# Altium schematic sheet [02] - BLOCK DIAGRAM.SchDoc
size A3; SheetNumber: 1; SheetTotal: 2
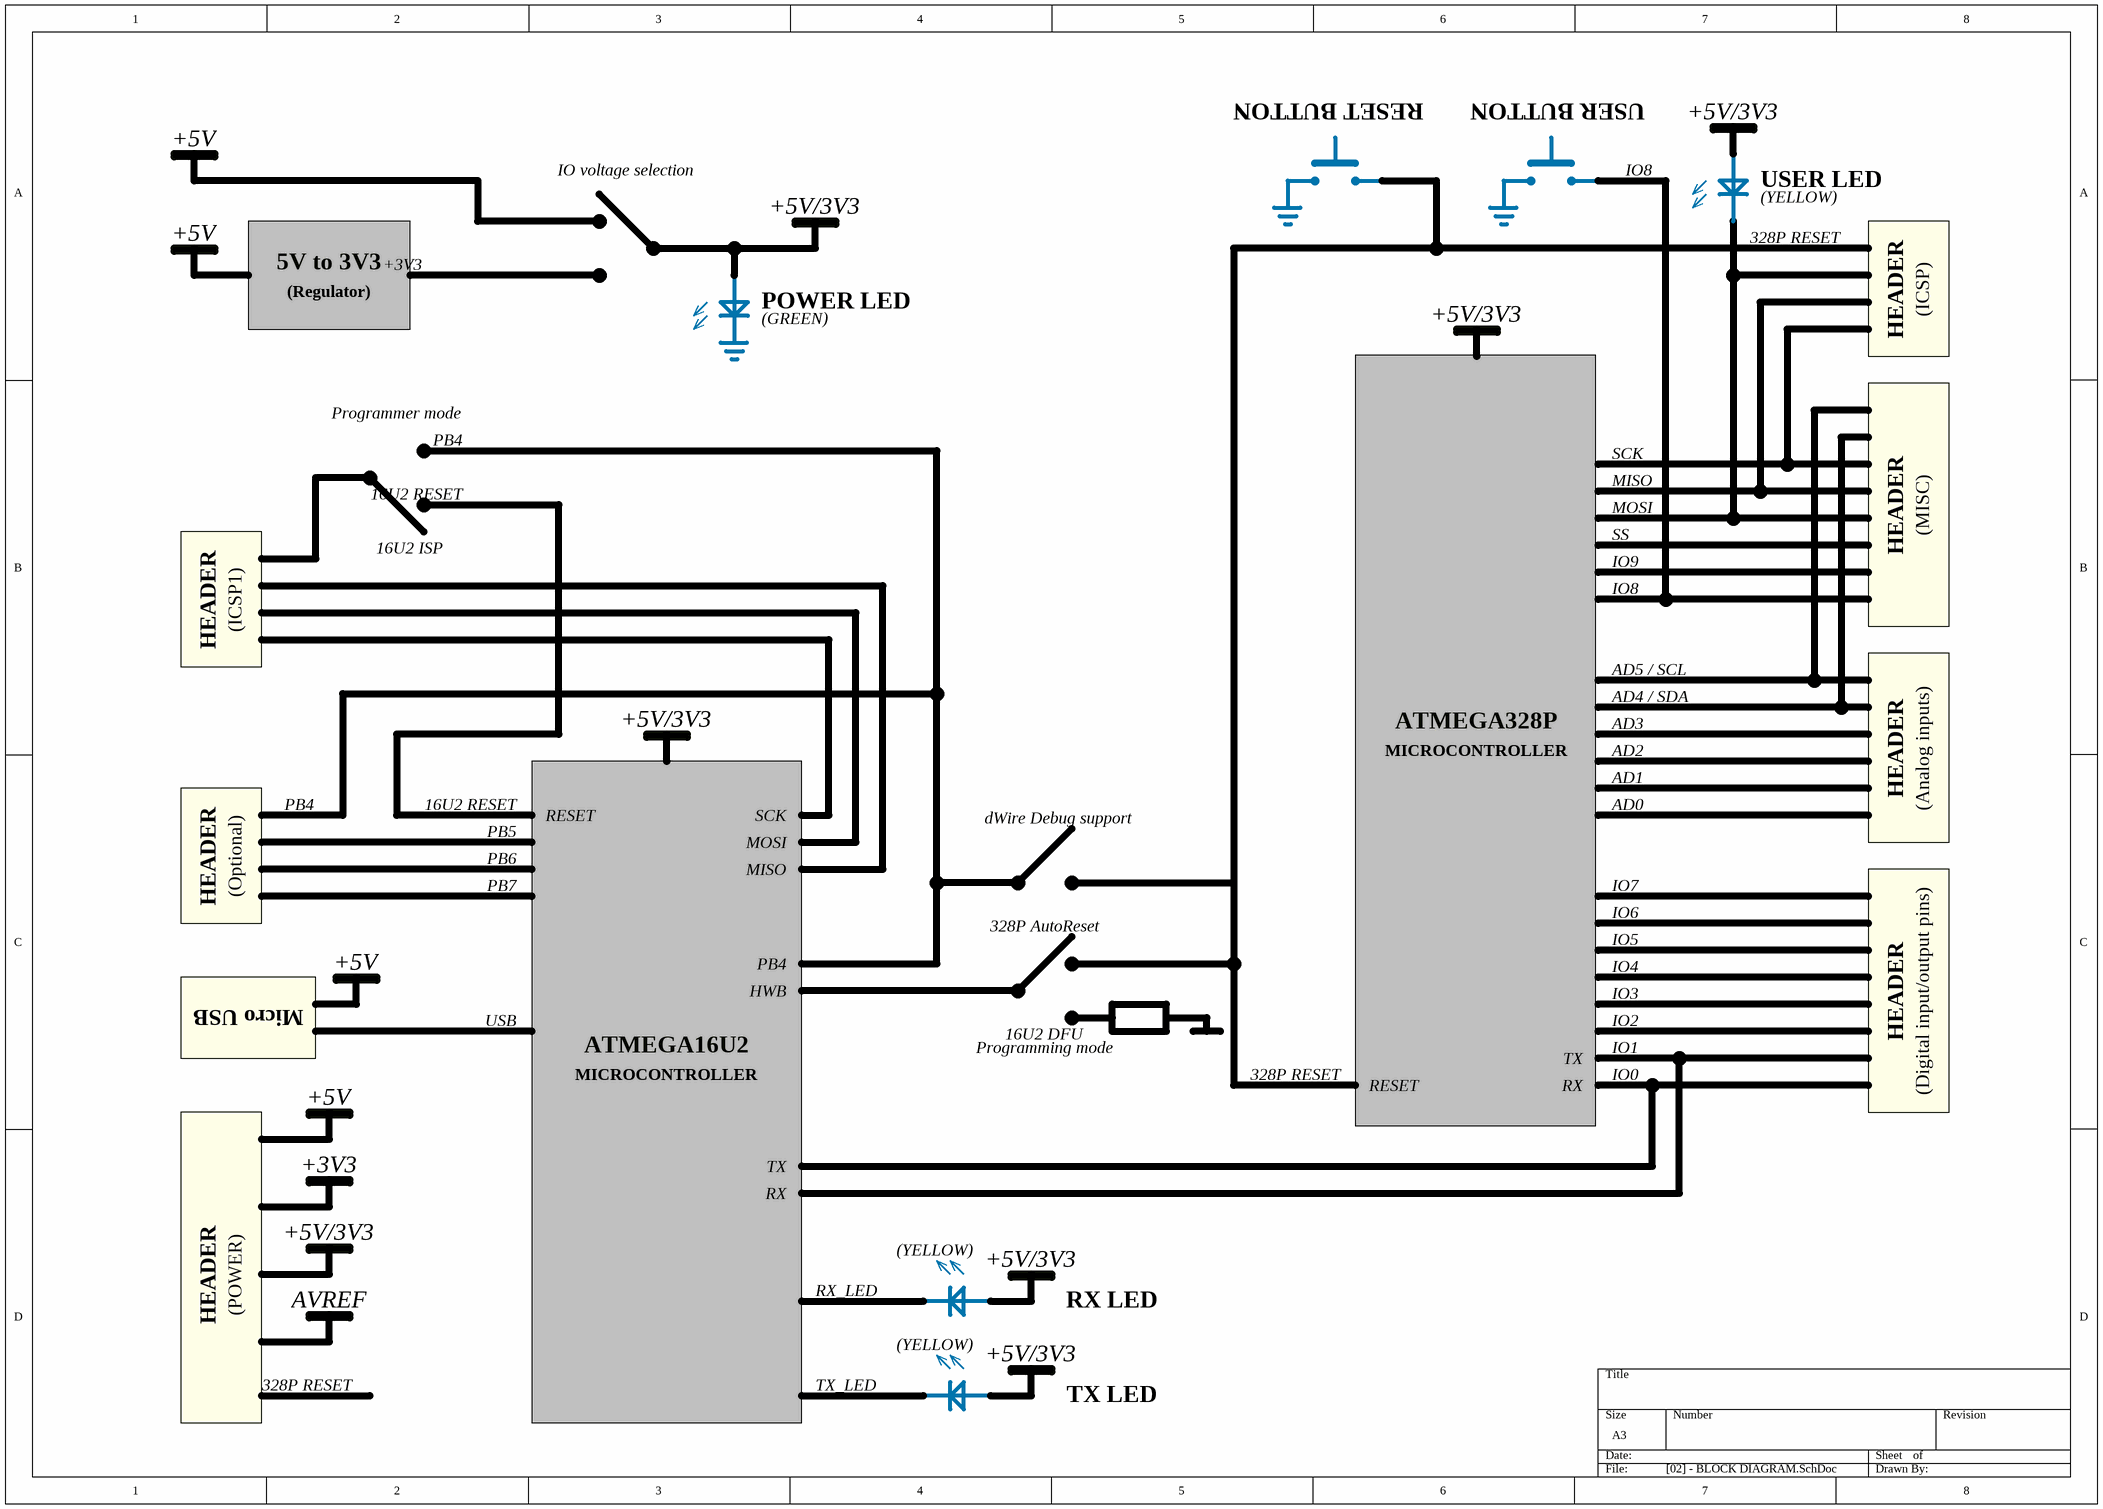
[diagram p0: [02] - BLOCK DIAGRAM.SchDoc]

## Notes on the sheet
- +5V
- IO voltage selection
- RESET BUTTON
- USER BUTTON
- IO8
- +5V/3V3
- USER LED
- (YELLOW)
- 328P RESET
- 5V to 3V3
- (Regulator)
- +3V3
- POWER LED
- HEADER
- (ICSP)
- (GREEN)
- Programmer mode
- PB4
- 16U2 RESET
- MISO
- MOSI
- SCK
- (MISC)
- 16U2 ISP
- SS
- IO9
- (ICSP1)
- ATMEGA328P
- AD5 / SCL
- AD4 / SDA
- MICROCONTROLLER
- AD3
- AD2
- AD1
- (Analog inputs)
- (Optional)
- PB5
- RESET
- dWire Debug support
- AD0
- PB6
- PB7
- IO7
- IO6
- HWB
- 328P AutoReset
- IO5
- IO4
- (Digital input/output pins)
- Micro USB
- USB
- ATMEGA16U2
- 16U2 DFU
- Programming mode
- TX
- IO3
- IO2
- IO1
- RX
- IO0
- (POWER)
- AVREF
- RX_LED
- RX LED
- TX_LED
- TX LED